# Altium project M1-Test-Board.PrjPcb (part 2 of 2)

## Sheet InputOutput.SchDoc: M1 Test Fixture Custom Board
size OrCAD B; Author: Leo Buchman; Revision: B; SheetNumber: 3; SheetTotal: 4
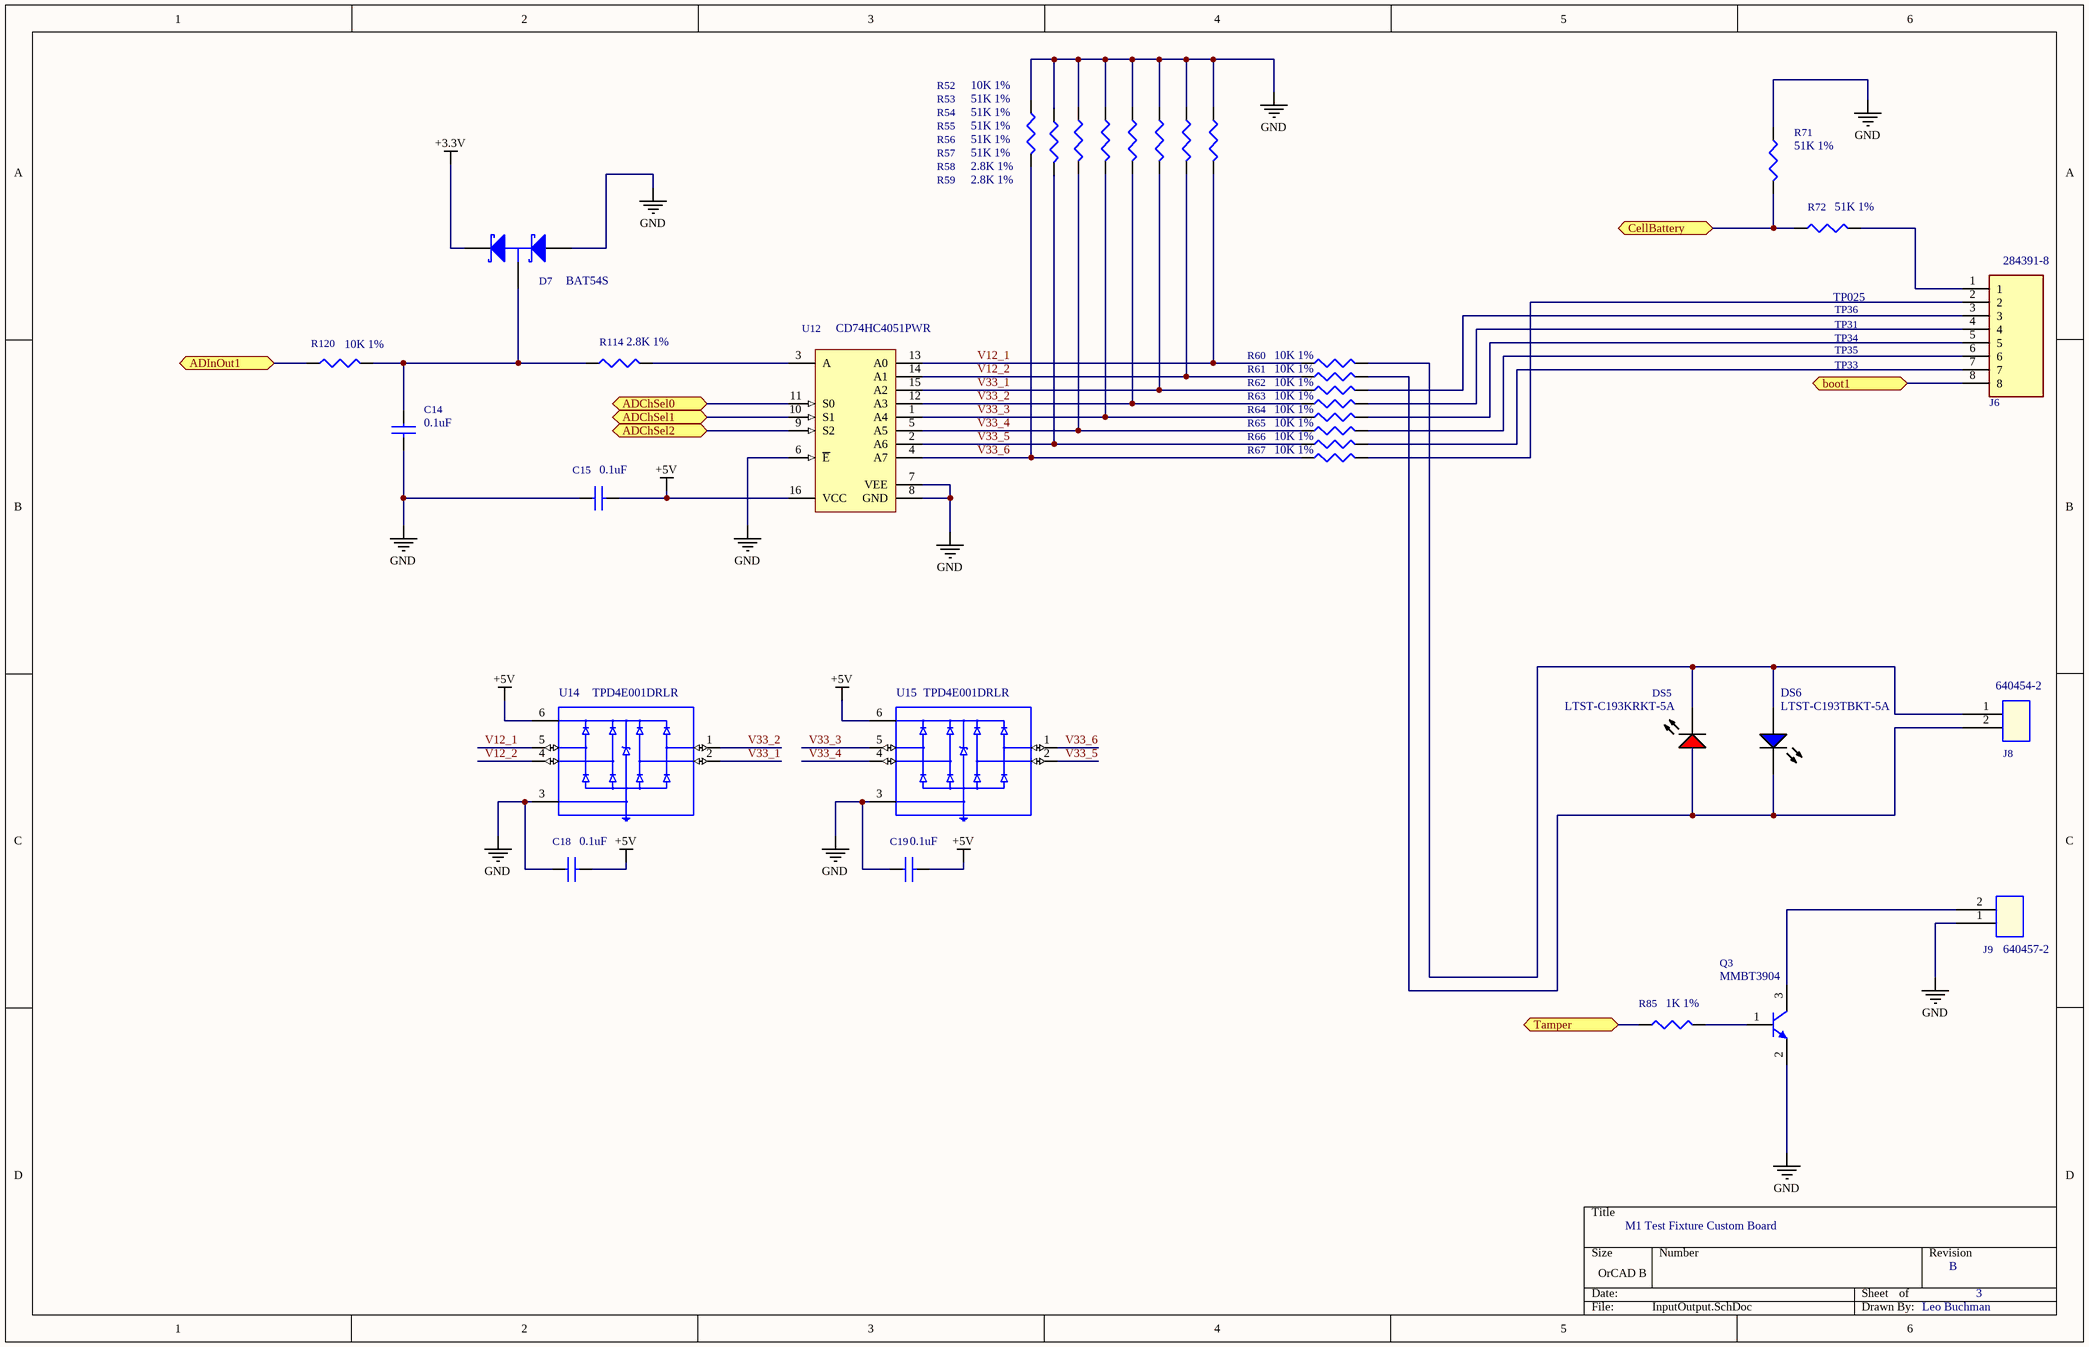
[diagram p3: InputOutput.SchDoc]

### Parts
C14  0.1uF  [C0402]
C15  0.1uF  [C0402]
C18  0.1uF  [C0402]
C19  0.1uF  [C0402]
D7  BAT54S  [sot23-3]
DS5  LTST-C193KRKT-5A  [LED-RED_0603]
DS6  LTST-C193TBKT-5A  [LED-BLUE_0603]
J6  284391-8  [TE_284391-8]
J8  640454-2  [CON$5C$2P$5C$100LM]
J9  640457-2  [TE_640457-2]
Q3  MMBT3904  [sot23-3]
R52  10K 1%  [R0402]
R53  51K 1%  [R0402]
R54  51K 1%  [R0402]
R55  51K 1%  [R0402]
R56  51K 1%  [R0402]
R57  51K 1%  [R0402]
R58  2.8K 1%  [R0402]
R59  2.8K 1%  [R0402]
R60  10K 1%  [R0402]
R61  10K 1%  [R0402]
R62  10K 1%  [R0402]
R63  10K 1%  [R0402]
R64  10K 1%  [R0402]
R65  10K 1%  [R0402]
R66  10K 1%  [R0402]
R67  10K 1%  [R0402]
R71  51K 1%  [R0402]
R72  51K 1%  [R0402]
R85  1K 1%  [R0402]
R114  2.8K 1%  [R0402]
R120  10K 1%  [R0402]
U12  CD74HC4051PWR  [16-TSSOP-4.4mm]
U14  TPD4E001DRLR  [SOTFL50P160X60-6N]
U15  TPD4E001DRLR  [SOTFL50P160X60-6N]

### Ports
ADChSel0 (bidir), ADChSel1 (bidir), ADChSel2 (bidir), ADInOut1 (bidir), boot1 (bidir), CellBattery (bidir), Tamper (bidir)

### Nets
+3.3V: D7.2(K)
+5V: C15.2 C18.2 C19.2 U12.16(VCC) U14.6(VCC) U15.6(VCC)
GND: C14.2 C15.1 C18.1 C19.1 D7.1(A) J9.1 Q3.2(E) R52.1 R53.1 R54.1 R55.1 R56.1 R57.1 R58.1 R59.1 R71.1 U12.6(~{E}) U12.7(VEE) U12.8(GND) U14.3(GND) U15.3(GND)
V12_1: R59.2 R60.1 U12.13(A0) U14.5(IO4)
V12_2: R58.2 R61.1 U12.14(A1) U14.4(IO3)
V33_1: R57.2 R62.1 U12.15(A2) U14.2(IO2)
V33_2: R56.2 R63.1 U12.12(A3) U14.1(IO1)
V33_3: R55.2 R64.1 U12.1(A4) U15.5(IO4)
V33_4: R54.2 R65.1 U12.5(A5) U15.4(IO3)
V33_5: R53.2 R66.1 U12.2(A6) U15.2(IO2)
V33_6: R52.2 R67.1 U12.4(A7) U15.1(IO1)
NetC14_1: C14.1 D7.3(C) R114.1 R120.2
NetDS5_1: DS5.1(A) DS6.2(K) J8.2 R61.2
NetDS5_2: DS5.2(K) DS6.1(A) J8.1 R60.2
NetJ6_1: J6.1 R72.2
NetJ6_2: J6.2 R67.2
NetJ6_3: J6.3 R62.2
NetJ6_4: J6.4 R63.2
NetJ6_5: J6.5 R64.2
NetJ6_6: J6.6 R65.2
NetJ6_7: J6.7 R66.2
NetJ6_8: J6.8 ; port boot1
NetJ9_2: J9.2 Q3.3(C)
NetQ3_1: Q3.1(B) R85.2
NetR71_2: R71.2 R72.1 ; port CellBattery
NetR85_1: R85.1 ; port Tamper
NetR114_2: R114.2 U12.3(A)
NetR120_1: R120.1 ; port ADInOut1
NetU2_36: U12.11(S0) ; port ADChSel0
NetU2_37: U12.10(S1) ; port ADChSel1
NetU2_38: U12.9(S2) ; port ADChSel2

### Notes on the sheet
- TP025
- TP36
- TP31
- TP34
- TP35
- TP33

### Library data of the parts
C14 C15 C18 C19 = Cap-00005: Cap Ceramic 0.1uF 50V X7R 10% Pad SMD 0402 125C Automotive T/R; Manufacturer: Murata; Manufacturer Part Number: GRT155R71H104KE01D; Part Name: Cap-00005; Supplier 1: Digi-Key; Supplier Part Number 1: 490-GRT155R71H104KE01DCT-ND; RoHS: Yes; Category: Ceramic Capacitors; Stock 1: 179948; Pricing 1: 1=0.10000, 10=0.04700, 50=0.02580, 100=0.0211; Mount: Surface Mount; Case/Package: 0402; Case Code (Metric): 1005; Case Code (Imperial): 0402; RoHS Compliant: Yes; LCSC Part Number: C307331; Number of Pins: 2; Dielectric Material: Ceramic; Termination: SMD/SMT; Voltage Rating (DC): 50V
D7 = Diode-0009: DIODE SCHOTTKY 30V 150MA SOT23-3; Manufacturer: Sangdest Microelectronics; Manufacturer: ON Semiconductor / Fairchild; Recovery Time: 5ns; Package Version: Rev. 12, 03/2016; Peak Reverse Current: 2uA; Elements: 2; Package Reference: SOT23-3; Package URL: http://www.fairchildsemi.com/dwg/MA/MA03D.pdf; Pins: 3; Datasheet URL: https://www.fairchildsemi.com/datasheets/BA/BAT54S.pdf; Manufacturer URL: https://www.fairchildsemi.com/; Datasheet Version: Rev. 2.3, 04/2016; Mounting Technology: SM; Package Description: 3-Pin Small Outline Transistor, Body 2.92 x 1.325 mm, Pitch 0.95 mm; Manufacturer Part Number: BAT54S; Component Type: Diodes; Part Name: Diode-0009; Supplier 1: Digi-Key; Supplier Part Number 1: 1655-BAT54SCT-ND; RoHS: Yes; Stock 1: 168252; Pricing 1: 1=0.43000, 10=0.35100, 100=0.18620, 500=0.122; Mount: Surface Mount; Radiation Hardening: No; Lead Free: Lead Free; LCSC Part Number: C47546
DS5 = Diode-0005: LED RED CLEAR 0603 SMD; Manufacturer: Vishay Lite-On; Manufacturer: Broadcom Avago; Type: Uni-Color; Product Height (mm): 1.1mm; Power Dissipation: 50mW; Product Length (mm): 3.2mm; Forward Voltage: 2.0V; Luminous Intensity: 45mcd; DELETED: Compliant; Shape Type: Rectangular; Peak Wavelength: 660nm; Main Category: ChipLED; Dominant Wave Length: 639nm; Rad Hardened: No; Lens Type: ColorlessDiffused; Product Depth (mm): 1.6mm; Reverse Voltage: 5V; Forward Current: 5mA; Chip Material: GaAlAs; Test Current (It): 20mA; Lum Intensity: 17mcd; Viewing Angle: 130°; Number of  Elements: 1; Lens Style: Diffused,Colorless,Clear,Rectangular; Dominant Wavelength: 631nm; Lens Color: Colorless; Package Reference: HSMX-C150; Package Description: 2-Pin Surface Mount Device, Body 3.2 x 1.6 mm; Operating Temp Range: -40Cto85C; Mounting: SurfaceMount; Emitting Color: Red; Pin Count: 2; Operating Temperature Classification: Industrial; Datasheet URL: http://media.digikey.com/pdf/Data%20Sheets/Avago%20PDFs/HSMz-Czzz.pdf; Package Type: ChipLed; Mounting Technology: SurfaceMount; High Brightness: No; Lens Dimensions: 2x1.6x0.6mm; Manufacturer URL: http://www.avagotech.com/; Datasheet Version: 03/2012; Packaging: Tape and Reel; Manufacturer Part Number: LTST-C193KRKT-5A; Part Name: Diode-0005; Supplier 1: Digi-Key; Supplier Part Number 1: 160-1830-1-ND; RoHS: Yes; Category: LEDs; Stock 1: 476214; Pricing 1: 1=0.39000, 10=0.20900, 100=0.09720, 500=0.089; Mount: Surface Mount; Case/Package: 0603; Case Code (Imperial): 0603; Case Code (Metric): 1608; RoHS Compliant: Yes; ComponentLink1URL: https://datasheet.ciiva.com/11775/0900766b80d; ComponentLink1Description: https://datasheet.ciiva.com/11775/0900766b80d; ComponentLink2URL: https://datasheet.ciiva.com/4689/100-ltst-c19; ComponentLink2Description: https://datasheet.ciiva.com/4689/100-ltst-c19; ComponentLink3URL: https://datasheet.ciiva.com/16210/ltst-c193kr; ComponentLink3Description: https://datasheet.ciiva.com/16210/ltst-c193kr; Number of Pins: 2; Min Operating Temperature: -55°C; Max Operating Temperature: 85°C; Package Quantity: 3000; Series: -; Radiation Hardening: No; Lead Free: Lead Free; ComponentLink4URL: https://datasheet.ciiva.com/2110/s-110-ltst-c; ComponentLink4Description: https://datasheet.ciiva.com/2110/s-110-ltst-c; LCSC Part Number: C2286; Color: Red; Number of Elements: 1; Test Current: 5mA; Number of LEDs: 1; Length: 1.6mm; Depth: 0.8mm; Illumination Color: Red; Lens Transparency: Clear; Width: 0.8mm; Height: 0.35mm
DS6 = Diode-0003: LED Blue CLEAR 0603 SMD; Manufacturer: Vishay Lite-On; Manufacturer: Rohm; Viewing Angle: 130°; Forward Voltage: 2.8V; Forward (Drive) Current: 20mA; Intensity: 22mcd; Lens Style: Diffused,Colorless,Rectangular,Clear; Luminous Intensity: 15mcd; Dominant Wavelength: 475nm; Number of Elements: 1; Power Dissipation: 76mW; Test Current: 5mA; Reverse Voltage: 5V; Lens Color: Colorless; Lens Type: Clear; Datasheet Version: Rev. 2.0, 03/2010; Package Description: 2-Pin Surface Mount Device, Body 1.6 x 0.8 mm; Mounting Technology: SurfaceMount; Dimension: 1.6x0.8x0.36mm; Package Reference: 1608; Datasheet URL: https://datasheet.ciiva.com/11773/0900766b80df3ad8-11773825.pdf; Color: Blue; Manufacturer URL: http://www.rohm.com/web/global/; Manufacturer Part Number: LTST-C193TBKT-5A; Part Name: Diode-0003; Supplier 1: Digi-Key; Supplier Part Number 1: 160-1827-1-ND; RoHS: Yes; Category: LEDs; Stock 1: 654851; Pricing 1: 1=0.30000, 10=0.23400, 100=0.10510, 500=0.094; Mount: Surface Mount; Case/Package: 0603; Case Code (Imperial): 0603; Case Code (Metric): 1608; Packaging: Tape and Reel; RoHS Compliant: Yes; ComponentLink1URL: https://datasheet.ciiva.com/2111/ltst-c193tbk; ComponentLink1Description: https://datasheet.ciiva.com/2111/ltst-c193tbk; ComponentLink2URL: https://datasheet.ciiva.com/11773/0900766b80d; ComponentLink2Description: https://datasheet.ciiva.com/11773/0900766b80d; ComponentLink3URL: https://datasheet.ciiva.com/4688/lite-on-ltst; ComponentLink3Description: https://datasheet.ciiva.com/4688/lite-on-ltst; Number of Pins: 2; Min Operating Temperature: -20°C; Max Operating Temperature: 80°C; Package Quantity: 1; Radiation Hardening: No; Lead Free: Lead Free; ComponentLink4URL: https://datasheet.ciiva.com/16210/ltst-c193tb; ComponentLink4Description: https://datasheet.ciiva.com/16210/ltst-c193tb; ComponentLink5URL: https://datasheet.ciiva.com/15201/getdatashee; ComponentLink5Description: https://datasheet.ciiva.com/15201/getdatashee; ComponentLink6URL: https://datasheet.ciiva.com/2111/p-100-ltst-c; ComponentLink6Description: https://datasheet.ciiva.com/2111/p-100-ltst-c; ComponentLink7URL: https://datasheet.ciiva.com/2111/p-100-ltst-c; ComponentLink7Description: https://datasheet.ciiva.com/2111/p-100-ltst-c; LCSC Part Number: C72041; Forward Current: 20mA; Number of LEDs: 1; Length: 1.6mm; Depth: 0.8mm; Illumination Color: Blue; Lens Transparency: Clear; Width: 0.8mm; Height: 0.35mm
J6 = CON-0011: Conn Terminal Block F 8 POS 3.5mm Solder ST T; MF: TE Connectivity; MP: 284391-8; SnapEDA_Link: https://www.snapeda.com/parts/284391-8/TE%20Connectivity%20AMP%20Connectors/view-part/2375722/?ref=snap; EU_RoHS_Compliance: Compliant with Exemptions; Package: None; Digi-Key_Purchase_URL: https://www.digikey.com.au/product-detail/en/te-connectivity-amp-connectors/284391-8/A98163-ND/1827025?utm_source=snapeda&utm_medium=aggregator&utm_campaign=symbol; Value: *; TE_purchase_URL: https://www.te.com/usa-en/product-284391-8.html?te_bu=Cor&te_type=disp&te_campaign=seda_glo_cor-seda-global-disp-prtnr-fy19-seda-model-bom-cta_sma-317_1&elqCampaignId=32493; Digi-Key_Part_Number: A98163-ND; Part Name: CON-0011; Supplier 1: Mouser; Supplier Part Number 1: 571-284391-8; Manufacturer: TE Connectivity; Manufacturer Part Number: 284391-8; RoHS: Yes; Stock 1: 530; Pricing 1: 1=5.54000, 10=3.52000, 50=3.52000, 100=3.4300; LCSC Part Number: N/A; Category: Terminal Blocks; Mount: Through Hole; Color: Green; Contact Material: Brass; Contact Plating: Tin
J8 = CON-0013: Header, Polarized; MTA-100; 2; 250 VAC; Polye; Manufacturer: TE Connectivity; Parameter 1: C86502; Part Name: CON-0013; Supplier 1: Digi-Key; Supplier Part Number 1: A19423-ND; Manufacturer Part Number: 640454-2; RoHS: Yes; Stock 1: 22525; Pricing 1: 1=0.16000, 10=0.12600, 100=0.09280, 500=0.076; LCSC Part Number: C86501; Category: Connectors; Mount: Through Hole; Color: Natural,White,Beige; Contact Material: Copper Alloy; Contact Plating: Tin; Housing Material: Polyester; Housing Color: Natural; Contact Shape: Square
J9 = CON-0014: MTA-100 HEADER  Friction Lock R/A 2POS 2.54MM; Manufacturer: AMP - TE CONNECTIVITY; Parameter 1: C86502; Part Name: CON-0014; Supplier 1: Digi-Key; Supplier Part Number 1: A1926-ND; Manufacturer Part Number: 640457-2; RoHS: No; LCSC Part Number: C86507; ComponentLink1URL: http://www.farnell.com/datasheets/2007196.pdf; ComponentLink1Description: http://www.farnell.com/datasheets/2007196.pdf; ComponentLink2URL: http://www.farnell.com/datasheets/2007196.pdf; ComponentLink2Description: http://www.farnell.com/datasheets/2007196.pdf; ComponentLink3URL: http://www.farnell.com/datasheets/2007196.pdf; ComponentLink3Description: http://www.farnell.com/datasheets/2007196.pdf
Q3 = Tran-0002: Trans GP BJT NPN 60V 0.2A 350mW Automotive 3-Pin SOT-23 T/R; Manufacturer: ON Semiconductor / Fairchild; Manufacturer: ON Semiconductor; Elements: 1; Power: 225mW; Frequency: 250MHz; Vce Max: 300mV; Max Collector Current: 200mA; Collector-emitter Voltage-Max: 400mV; Mounting Technology: SM; Min Operating Temperature: -55°C; Datasheet URL: http://www.onsemi.cn/pub_link/Collateral/MMBT3904LT1-D.PDF; Pins: 3; Package Description: 3-Pin Small Outline Transistor, Body 2.9 x 1.3 mm, Pitch 0.95 mm; Max Operating Temperature: 150°C; Package Reference: SOT-23 (318-08); RoHS Compliant: Yes; Datasheet Version: Rev. 12, 11/2012; Case/Package: SOT-23-3; Manufacturer Part Number: MMBT3904; Component Type: Transistors; Part Name: Tran-0002; LCSC Part Number: C20526; Supplier 1: Newark; Supplier Part Number 1: 58K9431; RoHS: Yes; Mount: Surface Mount; ComponentLink1URL: https://datasheet.ciiva.com/22664/1708270-226; ComponentLink1Description: https://datasheet.ciiva.com/22664/1708270-226; Polarity: NPN; Number of Elements: 1; Max Frequency: 250MHz; Length: 2.9mm; Width: 1.3mm; Height: 0.94mm; Radiation Hardening: No; Lead Free: Lead Free; REACH SVHC: No SVHC; ComponentLink2URL: https://datasheet.ciiva.com/4721/mmbt3906lt1-; ComponentLink2Description: https://datasheet.ciiva.com/4721/mmbt3906lt1-; ComponentLink3URL: https://datasheet.ciiva.com/11201/mmbt3906lt1; ComponentLink3Description: https://datasheet.ciiva.com/11201/mmbt3906lt1; ComponentLink4URL: https://datasheet.ciiva.com/16387/mmbt3906lt1; ComponentLink4Description: https://datasheet.ciiva.com/16387/mmbt3906lt1; ComponentLink5URL: https://datasheet.ciiva.com/976/mmbt3906lt1-d; ComponentLink5Description: https://datasheet.ciiva.com/976/mmbt3906lt1-d; ComponentLink6URL: https://datasheet.ciiva.com/976/mmbt3906lt1-d; ComponentLink6Description: https://datasheet.ciiva.com/976/mmbt3906lt1-d; ComponentLink7URL: https://datasheet.ciiva.com/976/mmbt3906lt1-d; ComponentLink7Description: https://datasheet.ciiva.com/976/mmbt3906lt1-d; Series: -
R52 R60-R67 R120 = Res-00002: Thick Film 0402 10K OHM 1% 1/16W 0402; Manufacturer: Yageo; Manufacturer Part Number: RC0402FR-0710KP; Max Power Dissipation: 63mW; Temperature Coefficient: 150ppm/°C; Power Rating: 62.5mW; Part Name: Res-00002; Supplier 1: Digi-Key; Supplier Part Number 1: YAG1249CT-ND; RoHS: Yes; Category: Chip SMD Resistors; Stock 1: 161500; Pricing 1: 1=0.10000, 10=0.03600, 100=0.01450, 1000=0.00; Case/Package: 0402; Case Code (Metric): 1005; Case Code (Imperial): 0402; Min Operating Temperature: -55°C; Max Operating Temperature: 155°C; Packaging: Tape and Reel; Resistance: 10k; Resistor Type: Thick Film; Number of Terminations: 2; Tolerance: 1%; Features: Moisture Resistant; Length: 0.039inch; Width: 0.02inch; Height: 0.016inch; RoHS Compliant: Yes; ComponentLink1URL: http://www.yageo.com/NewPortal/yageodocoutput; ComponentLink1Description: http://www.yageo.com/NewPortal/yageodocoutput; LCSC Part Number: C25744; Mount: Surface Mount
R53-R57 R71 R72 = Res-00011: Res Thick Film 0402 51K Ohm 1% 0.063W(1/16W) ±100ppm/C Pad SMD Automotive T/R; Manufacturer: Stackpole Electronics; Manufacturer Part Number: RMCF0402FT51K0; Resistance: 51kR; Max Power Dissipation: 63mW; Temperature Coefficient: 100ppm/°C; Part Name: Res-00011; Supplier 1: Digi-Key; Supplier Part Number 1: RMCF0402FT51K0CT-ND; RoHS: Yes; Category: Chip SMD Resistors; Stock 1: 588931; Pricing 1: 1=0.10000, 10=0.01500, 100=0.00610, 1000=0.00; Case/Package: 0402; Case Code (Metric): 1005; Case Code (Imperial): 0402; Min Operating Temperature: -55°C; Max Operating Temperature: 155°C; Packaging: Tape and Reel; Resistor Type: Thick Film; Number of Terminations: 2; Tolerance: 1%; Features: Automotive AEC-Q200; Length: 0.039inch; Width: 0.02inch; Height: 0.016inch; RoHS Compliant: Yes; ComponentLink1URL: http://components.arrow.com/part/dataview/535; ComponentLink1Description: http://components.arrow.com/part/dataview/535; ComponentLink2URL: https://www.seielect.com/catalog/SEI-RMCF_RMC; ComponentLink2Description: https://www.seielect.com/catalog/SEI-RMCF_RMC; ComponentLink3URL: https://www.seielect.com/Catalog/SEI-RMCF_RMC; ComponentLink3Description: https://www.seielect.com/Catalog/SEI-RMCF_RMC; ComponentLink4URL: https://www.seielect.com/catalog/SEI-Packagin; ComponentLink4Description: https://www.seielect.com/catalog/SEI-Packagin; LCSC Part Number: C25794; Mount: Surface Mount; Contact Plating: Tin,Matte; Power Rating: 63mW; Series: RMCF; Radiation Hardening: No
R58 R59 R114 = Res-00008: Thick Film 0402 2.8K Ohm 1% 0.063W ±100ppm/°C Molded SMD Paper T/R; Manufacturer: Stackpole Electronics; Manufacturer Part Number: RMCF0402FT2K80; Resistance: 2.8kR; Max Power Dissipation: 63mW; Power Rating: 62.5mW; Part Name: Res-00008; Supplier 1: Digi-Key; Supplier Part Number 1: RMCF0402FT2K80CT-ND; RoHS: Yes; Category: Chip SMD Resistors; Stock 1: 141882; Pricing 1: 1=0.10000, 10=0.01500, 100=0.00610, 1000=0.00; Case/Package: 0402; Case Code (Metric): 1005; Case Code (Imperial): 0402; Min Operating Temperature: -55°C; Max Operating Temperature: 155°C; Packaging: Tape and Reel; Resistor Type: Thick Film; Number of Terminations: 2; Tolerance: 1%; Temperature Coefficient: 100ppm/°C; Features: Automotive AEC-Q200; Length: 0.039inch; Width: 0.02inch; Height: 0.016inch; RoHS Compliant: Yes; ComponentLink1URL: https://www.seielect.com/catalog/SEI-RMCF_RMC; ComponentLink1Description: https://www.seielect.com/catalog/SEI-RMCF_RMC; ComponentLink2URL: https://www.seielect.com/Catalog/SEI-RMCF_RMC; ComponentLink2Description: https://www.seielect.com/Catalog/SEI-RMCF_RMC; ComponentLink3URL: https://www.seielect.com/catalog/SEI-Packagin; ComponentLink3Description: https://www.seielect.com/catalog/SEI-Packagin; LCSC Part Number: C62741; Mount: Surface Mount; Contact Plating: Tin,Matte; Series: RMCF; Radiation Hardening: No; Lead Free: Lead Free
R85 = Res-00001: Thick Film 0402 1K Ohm 1% 1/8W 0402; Manufacturer: TE Connectivity; Manufacturer Part Number: CRGP0402F1K0; Max Power Dissipation: 125mW; Temperature Coefficient: 100ppm/°C; Power Rating: 0.125W; Part Name: Res-00001; Supplier 1: Digi-Key; Supplier Part Number 1: A130355CT-ND; RoHS: Yes; Category: Chip SMD Resistors; Stock 1: 16450; Pricing 1: 1=0.12000, 10=0.11100, 100=0.04270, 1000=0.01; Case/Package: 0402; Case Code (Metric): 1005; Case Code (Imperial): 0402; Min Operating Temperature: -55°C; Max Operating Temperature: 155°C; Packaging: Tape and Reel; Resistance: 1k; Resistor Type: Thick Film; Number of Terminations: 2; Tolerance: 1%; RoHS Compliant: Yes; ComponentLink1URL: https://www.te.com/commerce/DocumentDelivery/; ComponentLink1Description: https://www.te.com/commerce/DocumentDelivery/; ComponentLink4Description: none; LCSC Part Number: C21190; Mount: Surface Mount
U12 = AIC-0001: 5-V, 8: 1, 1-channel analog mutliplexer 16-TS; Manufacturer: Texas Instruments; VCC(Max)(V): 6; Ron(Typ)(Ohms): 45; Rating: Catalog; VCC(Min)(V): 2; Ron(Max)(Ohms): 130; Configuration: 1 X 1：8 MUX; Crosstalk: Yes; Bandwidth(Max)(MHz): 180; Bandwidth: 180MHz; Propagation Delay: 60ns; Number of Outputs: 1; Max Supply Voltage: 6V; Min Supply Voltage: 2V; Number of Inputs: 8; Min Dual Supply Voltage: 1V; Max Dual Supply Voltage: 5V; Dual Supply Voltage: 3V; Logic Function: Multiplexer,Demultiplexer; On-State Resistance: 130R; Turn-On Delay Time: 225ns; Supply Type: Single,Dual; Nominal Supply Current: 16uA; Polarity: Non-Inverting; Low Level Output Current: 25mA; PackageVersion: http://www.ti.com/lit/ml/mpds178g/mpds178g.pdf; Generic Part Number: CD74HC4051; PackageReference: D0016A; Operating Temperature Range(C): -55 to 125; DatasheetVersion: SCHS122J; Code_JEDEC: MS-012 variation AC; Manufacturer Part Number: CD74HC4051PWR; Part Name: AIC-0001; LCSC Part Number: C352826; Supplier 1: Newark; Supplier Part Number 1: 29AH3620; RoHS: Yes; Category: Decoders and Multiplexers; Stock 1: 12645; Pricing 1: 1=0.33420, 10=0.26780, 30=0.23940, 100=0.2039; Mount: Surface Mount; Case/Package: TSSOP; Number of Pins: 16; Weight: 0.002183oz; Contact Plating: Gold; Min Operating Temperature: -55°C; Max Operating Temperature: 125°C; Package Quantity: 1; Packaging: Tape and Reel; Number of Channels: 1; Turn-Off Delay Time: 225ns; Number of Bits: 8; Series: 74HC; Number of Circuits: 1; High Level Output Current: 25mA; Number of Switches: 1; Max Output Current: 25mA; Termination: SMD/SMT; Supply Current: 16uA; Length: 5mm; Width: 4.4mm; Height: 1.15mm; Radiation Hardening: No; Lead Free: Lead Free; RoHS Compliant: Yes; REACH SVHC: No SVHC; ComponentLink1URL: https://datasheet.ciiva.com/15127/getdatashee; ComponentLink1Description: https://datasheet.ciiva.com/15127/getdatashee; ComponentLink2URL: https://datasheet.ciiva.com/27092/1326571-270; ComponentLink2Description: https://datasheet.ciiva.com/27092/1326571-270; ComponentLink3URL: https://datasheet.ciiva.com/1514/1789854-1514; ComponentLink3Description: https://datasheet.ciiva.com/1514/1789854-1514; ComponentLink4URL: https://datasheet.ciiva.com/1171/1633734-1171; ComponentLink4Description: https://datasheet.ciiva.com/1171/1633734-1171; ComponentLink5URL: https://datasheet.ciiva.com/1171/1633734-1171; ComponentLink5Description: https://datasheet.ciiva.com/1171/1633734-1171; ComponentLink6URL: https://datasheet.ciiva.com/2978/cd74hct4053-; ComponentLink6Description: https://datasheet.ciiva.com/2978/cd74hct4053-; ComponentLink7URL: https://datasheet.ciiva.com/46391/1840262-463; ComponentLink7Description: https://datasheet.ciiva.com/46391/1840262-463
U14 U15 = Diode-0012: TVS DIODE 5.5VWM SOT6; Manufacturer: Texas Instruments; Capacitance: 1.5pF; Max Power Dissipation: 100W; Breakdown Voltage: 11V; Direction: Unidirectional; Reverse Standoff Voltage: 5.5V; Clamping Voltage: 105.5V; Power Line Protection: Yes; Number of Channels: 4; Leakage Current: 1nA; Peak Pulse Current: 5.5A; Interface: LVDS,USB,Ethernet; Part Name: Diode-0012; Supplier 1: Digi-Key; Supplier Part Number 1: 296-21887-1-ND; Manufacturer Part Number: TPD4E001DRLR; RoHS: Yes; Category: ESD and Circuit Protection ICs; Stock 1: 42388; Pricing 1: 1=0.66000, 10=0.58100, 100=0.44520, 500=0.351; Mount: Surface Mount; Case/Package: SOT; Packaging: Tape and Reel; RoHS Compliant: Yes; ComponentLink1URL: https://datasheet.ciiva.com/5839/1535398-5839; ComponentLink1Description: https://datasheet.ciiva.com/5839/1535398-5839; ComponentLink2URL: https://datasheet.ciiva.com/22696/1831342-226; ComponentLink2Description: https://datasheet.ciiva.com/22696/1831342-226; ComponentLink3URL: https://datasheet.ciiva.com/1219/tpd4e001-121; ComponentLink3Description: https://datasheet.ciiva.com/1219/tpd4e001-121; Number of Pins: 6; Min Operating Temperature: -40°C; Max Operating Temperature: 85°C; Package Quantity: 1; Series: -; Radiation Hardening: No; Lead Free: Lead Free; ComponentLink4URL: https://datasheet.ciiva.com/15134/getdatashee; ComponentLink4Description: https://datasheet.ciiva.com/15134/getdatashee; ComponentLink5URL: https://datasheet.ciiva.com/7659/1853592-7659; ComponentLink5Description: https://datasheet.ciiva.com/7659/1853592-7659; ComponentLink6URL: https://datasheet.ciiva.com/338/tpd4e001-3380; ComponentLink6Description: https://datasheet.ciiva.com/338/tpd4e001-3380; ComponentLink7URL: https://datasheet.ciiva.com/338/tpd4e001-3380; ComponentLink7Description: https://datasheet.ciiva.com/338/tpd4e001-3380; ComponentLink8URL: https://datasheet.ciiva.com/338/tpd4e001-3380; ComponentLink8Description: https://datasheet.ciiva.com/338/tpd4e001-3380; LCSC Part Number: C527516; Length: 1.6mm; Depth: 1.2mm; Width: 1.2mm; Height: 0.55mm; Contact Plating: Gold; Weight: 9.9E-05oz; Termination: SMD/SMT; REACH SVHC: No SVHC; Min Breakdown Voltage: 11V; Peak Pulse Power: 100W; Polarity: Unidirectional; Working Voltage: 5.5V; Max Breakdown Voltage: 11V; Operating Supply Voltage: 5.5V; Number of Bidirectional Channels: 4; ComponentLink9URL: https://datasheet.ciiva.com/14423/tpd4e001-14; ComponentLink9Description: https://datasheet.ciiva.com/14423/tpd4e001-14

## Nets that join several sheets
+3.3V: Teensy (5 pins), RibbonCable (D5.2 D6.2), InputOutput (D7.2)
+5V: Teensy (7 pins), RibbonCable (25 pins), InputOutput (6 pins)
GND: Teensy (35 pins), RibbonCable (38 pins), InputOutput (21 pins)
NetJ5_3: Teensy (U2.18), RibbonCable (J5.3 U3.4)
NetJ5_6: Teensy (U2.19), RibbonCable (J5.6 U3.5)
NetJ6_8: Teensy (Q13.3), InputOutput (J6.8)
NetR71_2: Teensy (U2.39), InputOutput (R71.2 R72.1)
NetR85_1: Teensy (U2.33), InputOutput (R85.1)
NetR118_1: Teensy (U2.14), RibbonCable (R118.1)
NetR119_1: Teensy (U2.16), RibbonCable (R119.1)
NetR120_1: Teensy (U2.17), InputOutput (R120.1)
NetU2_36: Teensy (U2.36), RibbonCable (U5.11 U6.11), InputOutput (U12.11)
NetU2_37: Teensy (U2.37), RibbonCable (U5.10 U6.10), InputOutput (U12.10)
NetU2_38: Teensy (U2.38), RibbonCable (U5.9 U6.9), InputOutput (U12.9)